# Altium schematic sheet FPGA Cart.SchDoc: Cart
size Tabloid; ApprovedBy: NA; CompanyName: Cospan Design LLC; DrawnBy: David McCoy; Engineer: David McCoy; DocumentNumber: 12; Revision: A; SheetNumber: 12; SheetTotal: 18; Client: OSH; Project: Guppy Buddy; ProjectPrettyName: Guppy Buddy
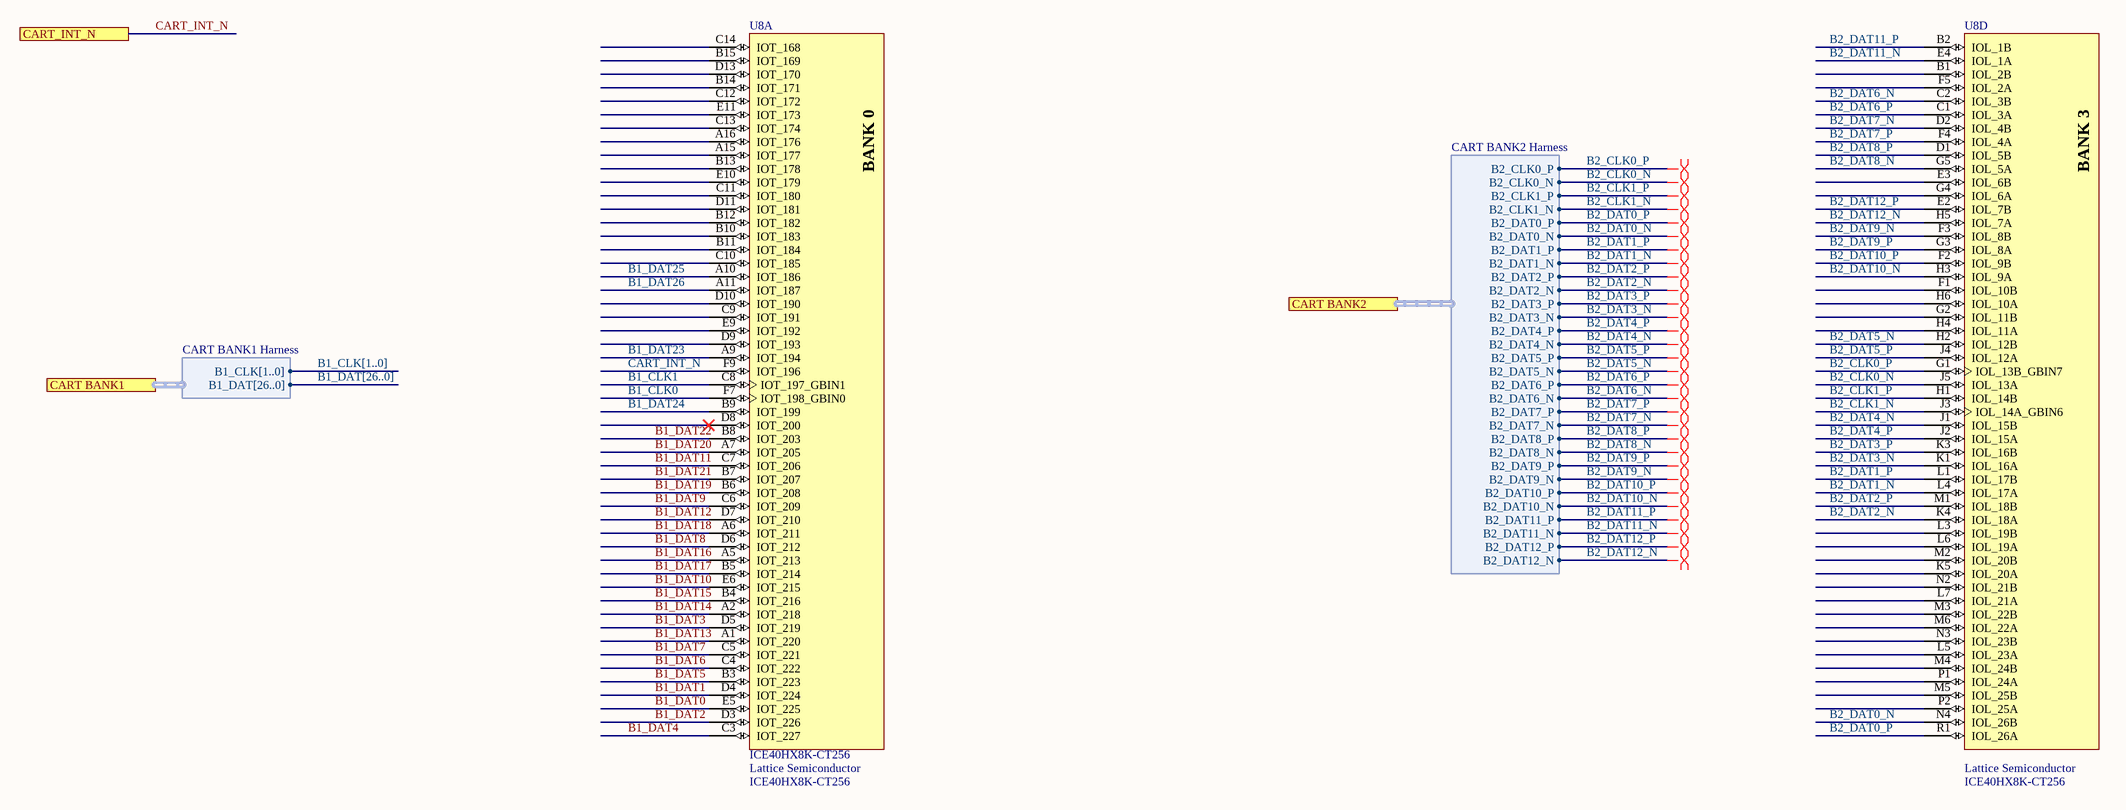
[diagram p0: FPGA Cart.SchDoc]

## Parts
U8  ICE40HX8K-CT256  Manufacturer 1: Lattice Semiconductor  [LATC-caBGA-256]  (parts A,D of 5)

## Ports
CART BANK1 (harness CART BANK1 Harness), CART BANK2 (harness CART BANK2 Harness), CART_INT_N

## Harnesses
CART BANK2 Harness: B2_CLK0_P, B2_CLK0_N, B2_CLK1_P, B2_CLK1_N, B2_DAT0_P, B2_DAT0_N, B2_DAT1_P, B2_DAT1_N, B2_DAT2_P, B2_DAT2_N, B2_DAT3_P, B2_DAT3_N, B2_DAT4_P, B2_DAT4_N, B2_DAT5_P, B2_DAT5_N, B2_DAT6_P, B2_DAT6_N, B2_DAT7_P, B2_DAT7_N, B2_DAT8_P, B2_DAT8_N, B2_DAT9_P, B2_DAT9_N, B2_DAT10_P, B2_DAT10_N, B2_DAT11_P, B2_DAT11_N, B2_DAT12_P, B2_DAT12_N
CART BANK1 Harness: B1_CLK[1..0], B1_DAT[26..0]

## Nets
B1_CLK0: U8.F7(IOT_198_GBIN0)
B1_CLK1: U8.C8(IOT_197_GBIN1)
B1_DAT0: U8.E5(IOT_225)
B1_DAT1: U8.D4(IOT_224)
B1_DAT2: U8.D3(IOT_226)
B1_DAT3: U8.D5(IOT_219)
B1_DAT4: U8.C3(IOT_227)
B1_DAT5: U8.B3(IOT_223)
B1_DAT6: U8.C4(IOT_222)
B1_DAT7: U8.C5(IOT_221)
B1_DAT8: U8.D6(IOT_212)
B1_DAT9: U8.C6(IOT_209)
B1_DAT10: U8.E6(IOT_215)
B1_DAT11: U8.C7(IOT_206)
B1_DAT12: U8.D7(IOT_210)
B1_DAT13: U8.A1(IOT_220)
B1_DAT14: U8.A2(IOT_218)
B1_DAT15: U8.B4(IOT_216)
B1_DAT16: U8.A5(IOT_213)
B1_DAT17: U8.B5(IOT_214)
B1_DAT18: U8.A6(IOT_211)
B1_DAT19: U8.B6(IOT_208)
B1_DAT20: U8.A7(IOT_205)
B1_DAT21: U8.B7(IOT_207)
B1_DAT22: U8.B8(IOT_203)
B1_DAT23: U8.A9(IOT_194)
B1_DAT24: U8.B9(IOT_199)
B1_DAT25: U8.A10(IOT_186)
B1_DAT26: U8.A11(IOT_187)
B2_CLK0_N: U8.J5(IOL_13A) ; port CART BANK2.B2_CLK0_N
B2_CLK0_P: U8.G1(IOL_13B_GBIN7) ; port CART BANK2.B2_CLK0_P
B2_CLK1_N: U8.J3(IOL_14A_GBIN6) ; port CART BANK2.B2_CLK1_N
B2_CLK1_P: U8.H1(IOL_14B) ; port CART BANK2.B2_CLK1_P
B2_DAT0_N: U8.N4(IOL_26B) ; port CART BANK2.B2_DAT0_N
B2_DAT0_P: U8.R1(IOL_26A) ; port CART BANK2.B2_DAT0_P
B2_DAT1_N: U8.L4(IOL_17A) ; port CART BANK2.B2_DAT1_N
B2_DAT1_P: U8.L1(IOL_17B) ; port CART BANK2.B2_DAT1_P
B2_DAT2_N: U8.K4(IOL_18A) ; port CART BANK2.B2_DAT2_N
B2_DAT2_P: U8.M1(IOL_18B) ; port CART BANK2.B2_DAT2_P
B2_DAT3_N: U8.K1(IOL_16A) ; port CART BANK2.B2_DAT3_N
B2_DAT3_P: U8.K3(IOL_16B) ; port CART BANK2.B2_DAT3_P
B2_DAT4_N: U8.J1(IOL_15B) ; port CART BANK2.B2_DAT4_N
B2_DAT4_P: U8.J2(IOL_15A) ; port CART BANK2.B2_DAT4_P
B2_DAT5_N: U8.H2(IOL_12B) ; port CART BANK2.B2_DAT5_N
B2_DAT5_P: U8.J4(IOL_12A) ; port CART BANK2.B2_DAT5_P
B2_DAT6_N: U8.C2(IOL_3B) ; port CART BANK2.B2_DAT6_N
B2_DAT6_P: U8.C1(IOL_3A) ; port CART BANK2.B2_DAT6_P
B2_DAT7_N: U8.D2(IOL_4B) ; port CART BANK2.B2_DAT7_N
B2_DAT7_P: U8.F4(IOL_4A) ; port CART BANK2.B2_DAT7_P
B2_DAT8_N: U8.G5(IOL_5A) ; port CART BANK2.B2_DAT8_N
B2_DAT8_P: U8.D1(IOL_5B) ; port CART BANK2.B2_DAT8_P
B2_DAT9_N: U8.F3(IOL_8B) ; port CART BANK2.B2_DAT9_N
B2_DAT9_P: U8.G3(IOL_8A) ; port CART BANK2.B2_DAT9_P
B2_DAT10_N: U8.H3(IOL_9A) ; port CART BANK2.B2_DAT10_N
B2_DAT10_P: U8.F2(IOL_9B) ; port CART BANK2.B2_DAT10_P
B2_DAT11_N: U8.E4(IOL_1A) ; port CART BANK2.B2_DAT11_N
B2_DAT11_P: U8.B2(IOL_1B) ; port CART BANK2.B2_DAT11_P
B2_DAT12_N: U8.H5(IOL_7A) ; port CART BANK2.B2_DAT12_N
B2_DAT12_P: U8.E2(IOL_7B) ; port CART BANK2.B2_DAT12_P
CART_INT_N: U8.F9(IOT_196) ; port CART_INT_N

Not connected (* = marked no-connect by the designer): U8 A15(IOT_177) A16(IOT_176) B1(IOL_2B) B10(IOT_183) B11(IOT_184) B12(IOT_182) B13(IOT_178) B14(IOT_171) B15(IOT_169) C9(IOT_191) C10(IOT_185) C11(IOT_180) C12(IOT_172) C13(IOT_174) C14(IOT_168) D8(IOT_200)* D9(IOT_193) D10(IOT_190) D11(IOT_181) D13(IOT_170) E3(IOL_6B) E9(IOT_192) E10(IOT_179) E11(IOT_173) F1(IOL_10B) F5(IOL_2A) G2(IOL_11B) G4(IOL_6A) H4(IOL_11A) H6(IOL_10A) K5(IOL_20A) L3(IOL_19B) L5(IOL_23A) L6(IOL_19A) L7(IOL_21A) M2(IOL_20B) M3(IOL_22B) M4(IOL_24B) M5(IOL_25B) M6(IOL_22A) N2(IOL_21B) N3(IOL_23B) P1(IOL_24A) P2(IOL_25A)

## Buses and harness runs
bus B1_CLK[1..0]
bus B1_DAT[26..0]

## Layout directives
differential pair: B2_CLK0_N, B2_CLK0_P, B2_CLK1_N, B2_CLK1_P, B2_DAT0_N, B2_DAT0_P, B2_DAT1_N, B2_DAT1_P, B2_DAT2_N, B2_DAT2_P, B2_DAT3_N, B2_DAT3_P, B2_DAT4_N, B2_DAT4_P, B2_DAT5_N, B2_DAT5_P, B2_DAT6_N, B2_DAT6_P, B2_DAT7_N, B2_DAT7_P, B2_DAT8_N, B2_DAT8_P, B2_DAT9_N, B2_DAT9_P, B2_DAT10_N, B2_DAT10_P, B2_DAT11_N, B2_DAT11_P, B2_DAT12_N, B2_DAT12_P

## Notes on the sheet
- Project:
- http://www.cospandesign.com
- Cospan Design
- Document:
- Engineer:
- Title:
- Client:
- Approved By:
- Revision:
- Date:
- Number:
- of
- (in symbol U_ICE40HX8K-CT256, part A) BANK 0
- (in symbol U_ICE40HX8K-CT256, part D) BANK 3

## Library data of the parts
U8 = U_ICE40HX8K-CT256: iCE40 HX8K Series FPGA Family, 7680 Logic Cells, 1.2 V Core, 128 K Embedded RAM Bits, 256-ball caBGA, Pb-Free, Tray; Supply Voltage: 1.2V; Phase-Locked Loops: 2; Logic Cells: 7680; Embedded RAM Bits: 128K; Description 1: IC FPGA HX 7680LUTS 1.2V 256BGA; Density: 128Kb; Number of Logic Blocks (LABs): 960; Number of I/Os: 206; Min Supply Voltage: 1.14V; Max Supply Voltage: 1.26V; RAM Size: 131072b; Max Frequency: 533MHz; PackageReference: caBGA-256; PackageDescription: 256-Ball Chip Array Ball Grid Array, Body 14 x 14 mm, Pitch 0.8 mm; RoHS: TRUE; Packing: Tray; Mounting Technology: Surface Mount; ComponentLink3URL: http://www.latticesemi.com/lit/docs/package/pkg.pdf; ComponentLink1Description: Manufacturer URL; ComponentLink3Description: Package Specification; Code_JEDEC: MO-275; PackageVersion: Rev. 03.9, 02/2013; ComponentLink1URL: http://www.latticesemi.com/en; ComponentLink2URL: http://www.latticesemi.com/~/media/Documents/DataSheets/iCE/iCE40LPHXFamilyDataSheet.pdf; PartNumber: ICE40HX8K-CT256; Manufacturer: Lattice Semiconductor; ComponentLink2Description: Datasheet; DatasheetVersion: Rev. 02.9; Supplier 1: Digi-Key; Supplier Part Number 1: 220-1575-ND; Stock 1: 549; Pricing 1: 1=11.41, 25=9.898, 100=9.4536 (USD); Case/Package: BGA; Number of Pins: 256; Weight: 0.098203oz; Min Operating Temperature: -40°C; Max Operating Temperature: 85°C; Package Quantity: 119; Packaging: Tray; Operating Supply Voltage: 1.2V; Number of Gates: 7680; Number of Logic Elements/Cells: 7680; Memory Size: 128Kb; Number of Registers: 7680; Length: 14mm; Height: 17mm; Width: 14mm; Lead Free: Lead Free; ComponentLink4URL: http://www.mouser.com/ds/2/225/iCE40FamilyHandbook-311139.pdf; ComponentLink4Description: http://www.mouser.com/ds/2/225/iCE40FamilyHandbook-311139.pdf; Manufacturer Part Number 1: ICE40HX8K-CT256